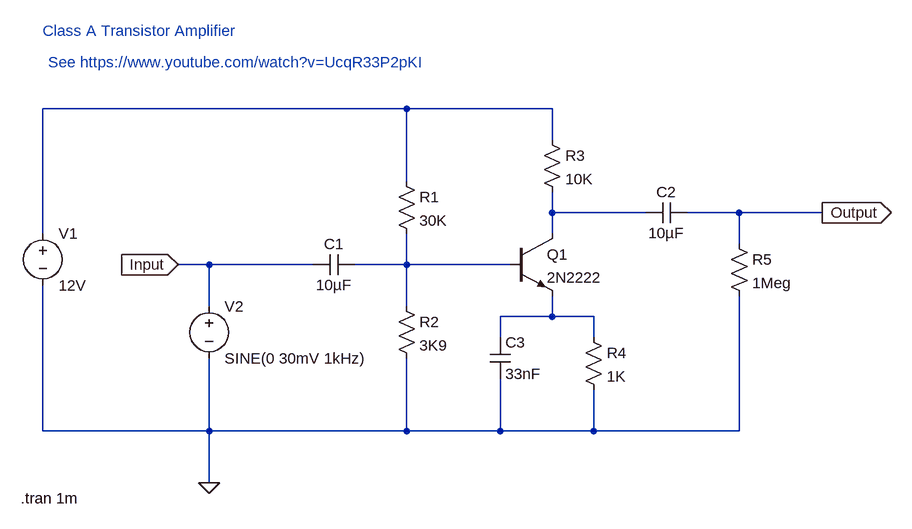
[diagram p0: schematic classaq.asc]
classaq.asc, the LTspice schematic file:
Version 4
SHEET 1 924 680
WIRE 144 -64 -416 -64
WIRE 368 -64 144 -64
WIRE 368 -16 368 -64
WIRE 144 48 144 -64
WIRE 368 96 368 64
WIRE 512 96 368 96
WIRE 656 96 576 96
WIRE 784 96 656 96
WIRE -416 128 -416 -64
WIRE 368 128 368 96
WIRE 656 144 656 96
WIRE -160 176 -208 176
WIRE 0 176 -160 176
WIRE 144 176 144 128
WIRE 144 176 64 176
WIRE 304 176 144 176
WIRE -160 240 -160 176
WIRE 144 240 144 176
WIRE 368 256 368 224
WIRE 368 256 288 256
WIRE 432 256 368 256
WIRE 288 288 288 256
WIRE 432 288 432 256
WIRE -416 432 -416 208
WIRE -160 432 -160 320
WIRE -160 432 -416 432
WIRE 144 432 144 320
WIRE 144 432 -160 432
WIRE 288 432 288 352
WIRE 288 432 144 432
WIRE 432 432 432 368
WIRE 432 432 288 432
WIRE 656 432 656 224
WIRE 656 432 432 432
WIRE -160 512 -160 432
FLAG -160 512 0
FLAG -208 176 Input
IOPIN -208 176 In
FLAG 784 96 Output
IOPIN 784 96 Out
SYMBOL npn 304 128 R0
SYMATTR InstName Q1
SYMATTR Value 2N2222
SYMBOL voltage -416 112 R0
WINDOW 123 0 0 Left 0
WINDOW 39 0 0 Left 0
SYMATTR InstName V1
SYMATTR Value 12V
SYMBOL voltage -160 224 R0
WINDOW 123 0 0 Left 0
WINDOW 39 0 0 Left 0
SYMATTR InstName V2
SYMATTR Value SINE(0 30mV 1kHz)
SYMBOL res 128 32 R0
SYMATTR InstName R1
SYMATTR Value 30K
SYMBOL res 128 224 R0
SYMATTR InstName R2
SYMATTR Value 3K9
SYMBOL res 352 -32 R0
SYMATTR InstName R3
SYMATTR Value 10K
SYMBOL res 416 272 R0
SYMATTR InstName R4
SYMATTR Value 1K
SYMBOL res 640 128 R0
SYMATTR InstName R5
SYMATTR Value 1Meg
SYMBOL cap 64 160 R90
WINDOW 0 0 32 VBottom 2
WINDOW 3 32 32 VTop 2
SYMATTR InstName C1
SYMATTR Value 10µF
SYMBOL cap 576 80 R90
WINDOW 0 0 32 VBottom 2
WINDOW 3 32 32 VTop 2
SYMATTR InstName C2
SYMATTR Value 10µF
SYMBOL cap 272 288 R0
SYMATTR InstName C3
SYMATTR Value 33nF
TEXT -450 536 Left 2 !.tran 1m
TEXT -416 -184 Left 2 ;Class A Transistor Amplifier
TEXT -408 -136 Left 2 ;See https://www.youtube.com/watch?v=UcqR33P2pKI

The netlist it stands for:
* classaq.asc
Q1 N002 N003 N004 0 2N2222
V1 N001 0 12V
V2 Input 0 SINE(0 30mV 1kHz)
R1 N001 N003 30K
R2 N003 0 3K9
R3 N001 N002 10K
R4 N004 0 1K
R5 Output 0 1Meg
C1 N003 Input 10µF
C2 Output N002 10µF
C3 N004 0 33nF
.model NPN NPN
.model PNP PNP
.lib standard.bjt
.tran 1m
* Class A Transistor Amplifier
* See https://www.youtube.com/watch?v=UcqR33P2pKI
.backanno
.end